# EAGLE design polarplotter allegro v3 (EAGLE 5.07)
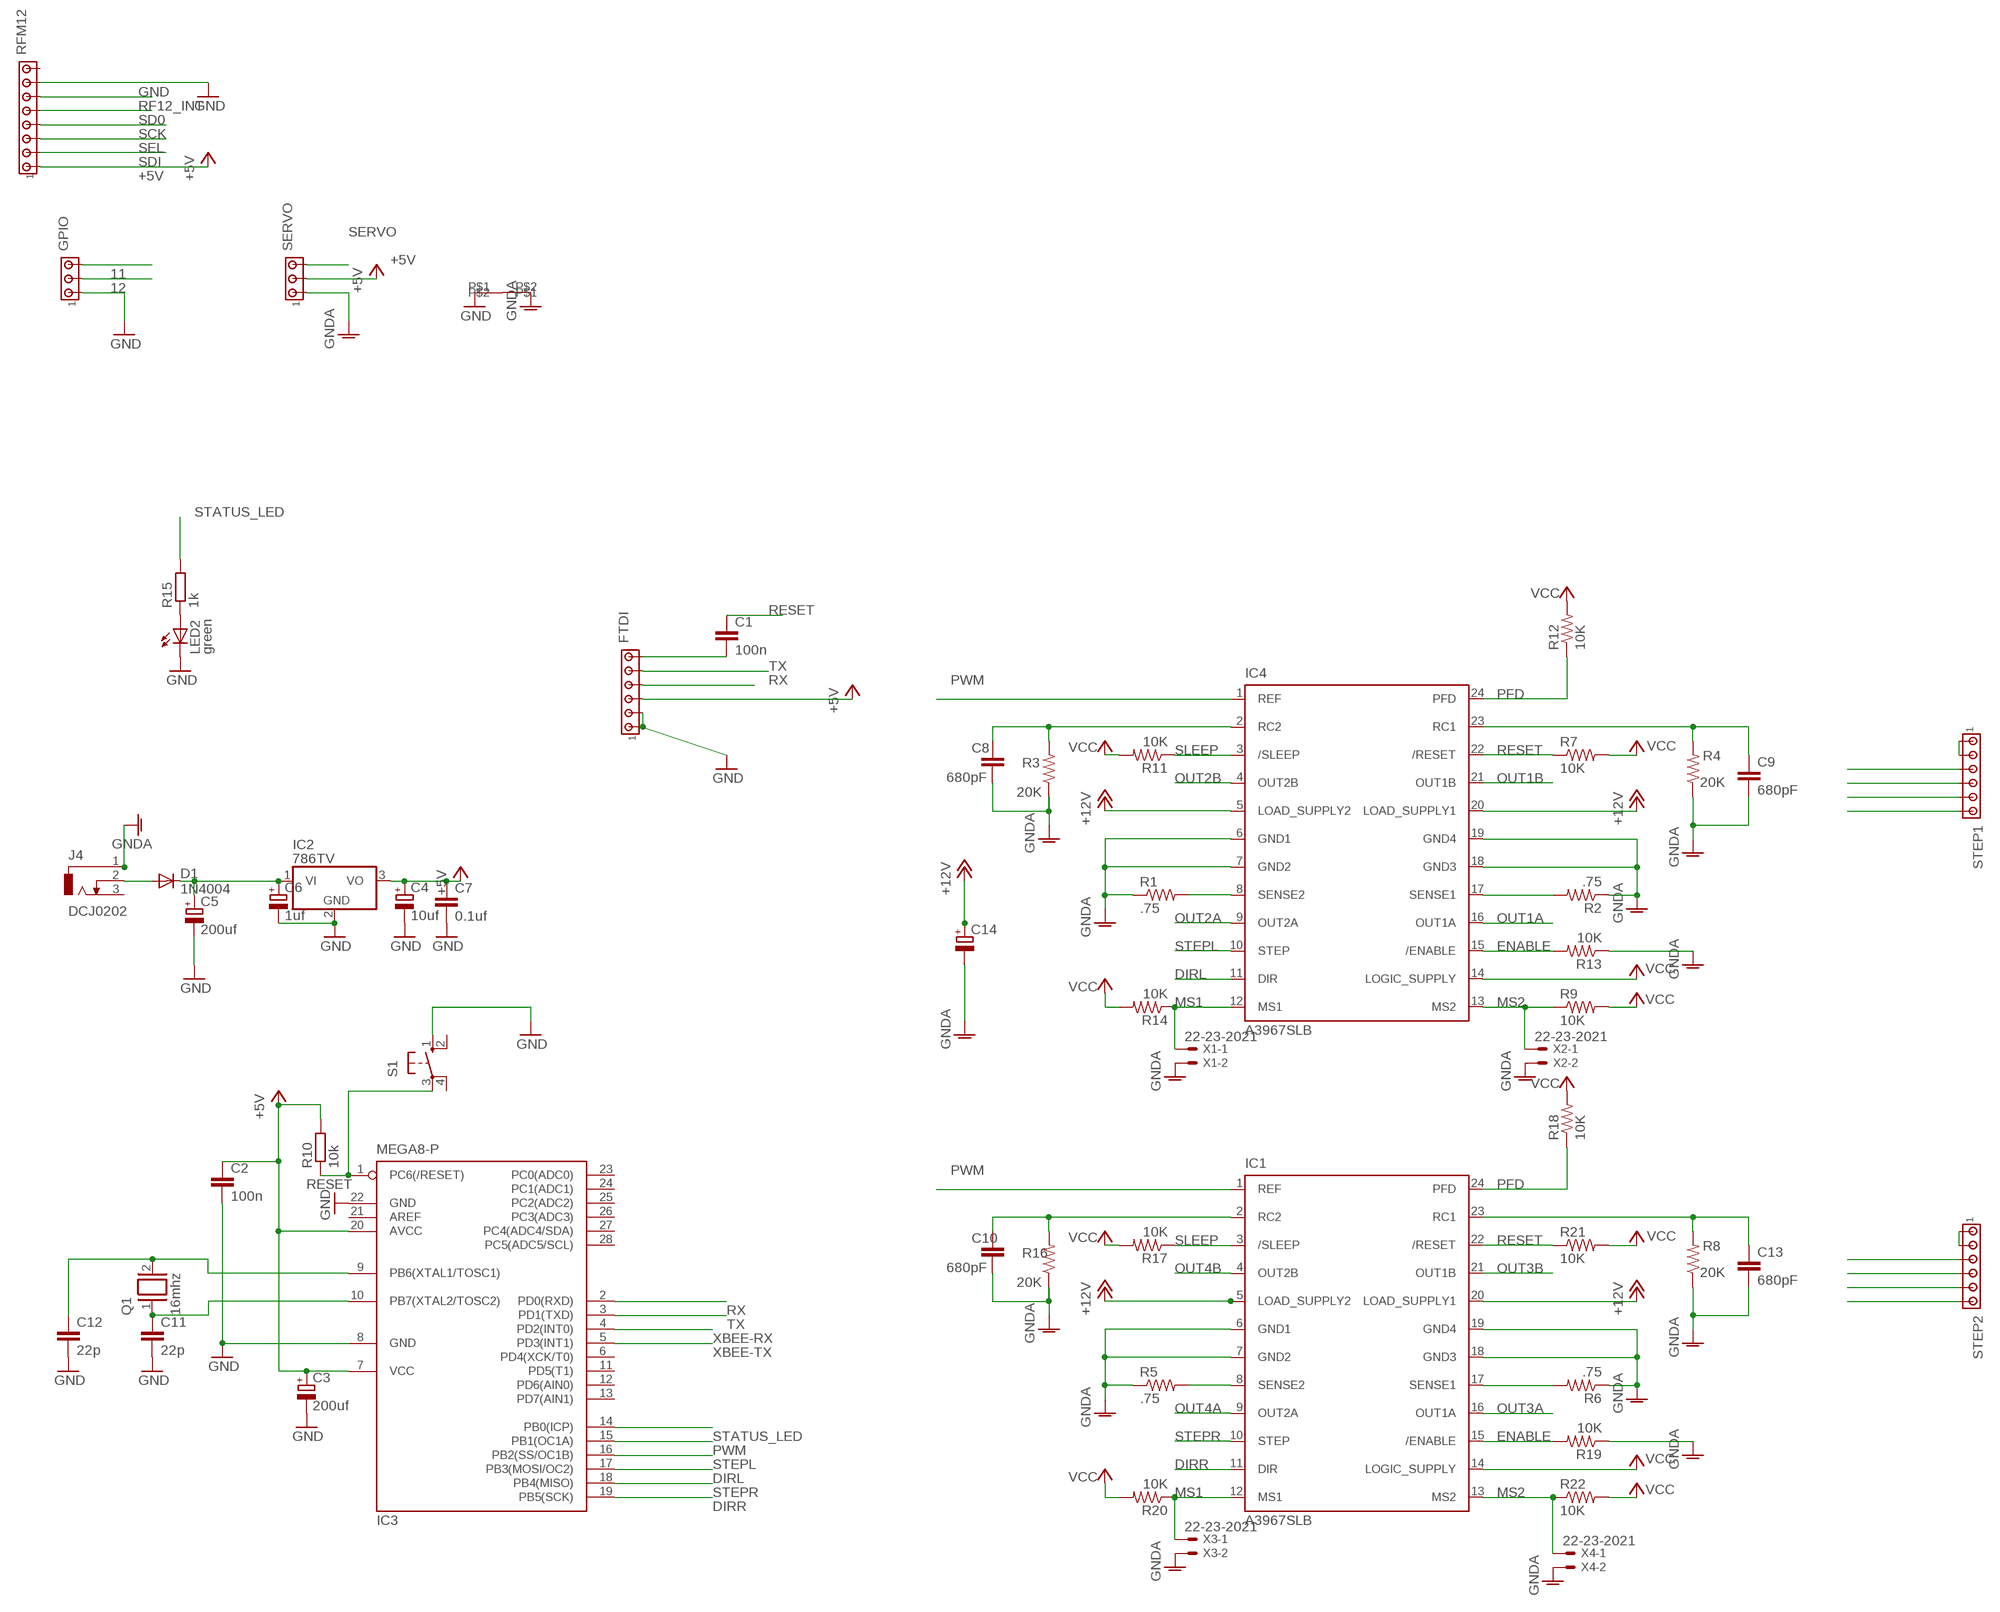
[diagram p0: schematic, sheet 1]

## Parts
C1  100n  C-EU050-025X075  [C050-025X075]
C2  100n  C-EU050-025X075  [C050-025X075]
C3  200uf  CPOL-EUE2-4  [E2-4]
C4  10uf  CPOL-EUE2-4  [E2-4]
C5  200uf  CPOL-EUE3.5-8  [E3,5-8]
C6  1uf  CPOL-EUE2-4  [E2-4]
C7  0.1uf  C-EU050-025X075  [C050-025X075]
C8  680pF  CAP0402  [C0402]
C9  680pF  CAP0402  [C0402]
C10  680pF  CAP0402  [C0402]
C11  22p  C-EU050-025X075  [C050-025X075]
C12  22p  C-EU050-025X075  [C050-025X075]
C13  680pF  CAP0402  [C0402]
C14  CPOL-EU153CLV-0810  [153CLV-0810]
D1  1N4004  [DO41-10]
FTDI  MTA06-100  [10X06MTA]
GPIO  MTA03-100  [10X03MTA]
IC1  A3967SLB  [SO24W]
IC2  786TV  [TO220V]
IC3  MEGA8-P  [DIL28-3]
IC4  A3967SLB  [SO24W]
J4  DCJ0202  [DCJ0202]
LED2  green  LED5MM  [LED5MM]
Q1  16mhz  XTAL/S  [QS]
R1  .75  R-US_R0805  [R0805]
R2  .75  R-US_R0805  [R0805]
R3  20K  RESISTOR0402  [C0402]
R4  20K  RESISTOR0402  [C0402]
R5  .75  R-US_R0805  [R0805]
R6  .75  R-US_R0805  [R0805]
R7  10K  RESISTOR0402  [C0402]
R8  20K  RESISTOR0402  [C0402]
R9  10K  RESISTOR0402  [C0402]
R10  10k  R-EU_0204/7  [0204/7]
R11  10K  RESISTOR0402  [C0402]
R12  10K  RESISTOR0402  [C0402]
R13  10K  RESISTOR0402  [C0402]
R14  10K  RESISTOR0402  [C0402]
R15  1k  R-EU_0204/7  [0204/7]
R16  20K  RESISTOR0402  [C0402]
R17  10K  RESISTOR0402  [C0402]
R18  10K  RESISTOR0402  [C0402]
R19  10K  RESISTOR0402  [C0402]
R20  10K  RESISTOR0402  [C0402]
R21  10K  RESISTOR0402  [C0402]
R22  10K  RESISTOR0402  [C0402]
RFM12  MTA08-100  [10X08MTA]
S1  10-XX  [B3F-10XX]
SERVO  MTA03-100  [10X03MTA]
STEP1  MTA06-100  [10X06MTA]
STEP2  MTA06-100  [10X06MTA]
U$4  SHORT  [SHORT]
X1  22-23-2021  [22-23-2021]
X2  22-23-2021  [22-23-2021]
X3  22-23-2021  [22-23-2021]
X4  22-23-2021  [22-23-2021]

## Nets
11: GPIO.3
12: GPIO.2
+5V: C2.1 C3.+ C4.+ C7.1 FTDI.4 IC2.3(VO) IC3.7(VCC) IC3.20(AVCC) R10.2 R12.2 R18.2 RFM12.1 SERVO.2 ; supply symbol labelled VCC
+12V [power]: C14.+ IC1.5(LOAD_SUPPLY2) IC1.20(LOAD_SUPPLY1) IC4.5(LOAD_SUPPLY2) IC4.20(LOAD_SUPPLY1)
DIRL: IC3.17(PB3(MOSI/OC2)) IC4.11(DIR)
DIRR: IC1.11(DIR) IC3.19(PB5(SCK))
ENABLE: IC1.15(/ENABLE) IC4.15(/ENABLE) R13.2 R19.2
GND: C2.2 C3.- C4.- C5.- C6.- C7.2 C11.2 C12.2 FTDI.5 FTDI.6 GPIO.1 IC2.2(GND) IC3.8(GND) IC3.22(GND) LED2.K(C) RFM12.7 S1.1(S) U$4.P$1
GNDA [power]: C8.2 C9.2 C10.2 C13.2 C14.- IC1.6(GND1) IC1.7(GND2) IC1.18(GND3) IC1.19(GND4) IC4.6(GND1) IC4.7(GND2) IC4.18(GND3) IC4.19(GND4) J4.1 R1.1 R2.1 R3.1 R4.1 R5.1 R6.1 R8.1 R13.1 R16.1 R19.1 SERVO.1 U$4.P$2 X1.2 X2.2 X3.2 X4.2
MOTORSUPPLY [power]: STEP1.5 STEP1.6
MOTORSUPPLY1 [power]: STEP2.5 STEP2.6
MS1: IC1.12(MS1) IC4.12(MS1) R14.1 R20.1 X1.1 X3.1
MS2: IC1.13(MS2) IC4.13(MS2) R9.1 R22.1 X2.1 X4.1
N$1: IC1.8(SENSE2) R5.2
N$2: D1.A J4.2
N$3: IC4.8(SENSE2) R1.2
N$4: IC1.17(SENSE1) R6.2
N$5: C1.2 FTDI.1
N$6: C10.1 IC1.2(RC2) R16.2
N$7: C13.1 IC1.23(RC1) R8.2
N$10: C11.1 IC3.10(PB7(XTAL2/TOSC2)) Q1.1
N$11: C12.1 IC3.9(PB6(XTAL1/TOSC1)) Q1.2
N$14: IC4.17(SENSE1) R2.2
N$15: LED2.A R15.1
N$16: C8.1 IC4.2(RC2) R3.2
N$19: C5.+ C6.+ D1.C IC2.1(VI)
N$20: C9.1 IC4.23(RC1) R4.2
OUT1A: IC4.16(OUT1A) STEP1.4
OUT1B: IC4.21(OUT1B) STEP1.3
OUT2A: IC4.9(OUT2A) STEP1.2
OUT2B: IC4.4(OUT2B) STEP1.1
OUT3A: IC1.16(OUT1A) STEP2.4
OUT3B: IC1.21(OUT1B) STEP2.3
OUT4A: IC1.9(OUT2A) STEP2.2
OUT4B: IC1.4(OUT2B) STEP2.1
PFD: IC1.24(PFD) IC4.24(PFD) R12.1 R18.1
PWM: IC1.1(REF) IC3.15(PB1(OC1A)) IC4.1(REF)
RESET: C1.1 IC1.22(/RESET) IC3.1(PC6(/RESET)) IC4.22(/RESET) R7.1 R10.1 R21.1 S1.3(P)
RF12_INT: RFM12.6
RX: FTDI.3 IC3.2(PD0(RXD))
SCK: RFM12.4
SD0: RFM12.5
SDI: RFM12.2
SEL: RFM12.3
SERVO: SERVO.3
SLEEP: IC1.3(/SLEEP) IC4.3(/SLEEP) R11.1 R17.1
STATUS_LED: IC3.14(PB0(ICP)) R15.2
STEPL: IC3.16(PB2(SS/OC1B)) IC4.10(STEP)
STEPR: IC1.10(STEP) IC3.18(PB4(MISO))
TX: FTDI.2 IC3.3(PD1(TXD))
VCC: IC1.14(LOGIC_SUPPLY) IC4.14(LOGIC_SUPPLY) R7.2 R9.2 R11.2 R14.2 R17.2 R20.2 R21.2 R22.2
XBEE-RX: IC3.4(PD2(INT0))
XBEE-TX: IC3.5(PD3(INT1))
Unconnected: IC3.6(PD4(XCK/T0)) IC3.11(PD5(T1)) IC3.12(PD6(AIN0)) IC3.13(PD7(AIN1)) IC3.21(AREF) IC3.23(PC0(ADC0)) IC3.24(PC1(ADC1)) IC3.25(PC2(ADC2)) IC3.26(PC3(ADC3)) IC3.27(PC4(ADC4/SDA)) IC3.28(PC5(ADC5/SCL)) J4.3 RFM12.8 S1.2(S1) S1.4(P1)

## Library data of the parts
C1 C2 C7 C11 C12 = matt rcl:C-EU: CAPACITOR, European symbol
C3-C6 C14 = matt rcl:CPOL-EU: POLARIZED CAPACITOR, European symbol
C8-C10 C13 = SparkFun03_30_09:CAP: Capacitor Standard 0603 ceramic capacitor, and 0.1" leaded capacitor.
D1 = matt diode:1N4004: DIODE general purpose rectifier, 1 A
FTDI STEP1 STEP2 = matt con-amp:MTA06-100: AMP connector
GPIO SERVO = matt con-amp:MTA03-100: AMP connector
IC1 IC4 = Allegro:A3967SLB: ANALOG DEVICES
IC2 = linear:78*: Positive VOLTAGE REGULATOR Source: http://cache.national.com/ds/LM/LM78L05.pdf http://www.fairchildsemi.com/ds/LM/LM7805.pdf
IC3 = matt atmel:MEGA8-P: MICROCONTROLLER 8 Kbytes FLASH, 1 kbytes SRAM, 512 bytes EEPROM, USART, 4-channel 10 bit ADC, 2-channel 8 bit ADC Pin compatible with Atmega48, ATMega88, ATMega168 Source: avr.lbr
J4 = con-jack:DCJ0202: DC POWER JACK Source: DCJ0202.pdf
LED2 = matt led:LED: LED OSRAM: - CHIPLED LG R971, LG N971, LY N971, LG Q971, LY Q971, LO R971, LY R971 LH N974, LH R974 LS Q976, LO Q976, LY Q976 LO Q996 - Hyper CHIPLED LW Q18S LB Q993, LB Q99A, LB R99A - SideLED LS A670, LO A670, LY A670, LG A670, LP A670 LB A673, LV A673, LT A673, LW A673 LH A674 LY A675 LS A676, LA A676, LO A676, LY A676, LW A676 LS A679, LY A679, LG A679 - Hyper Micro SIDELED® LS Y876, LA Y876, LO Y876, LY Y876 LT Y87S - SmartLED LW L88C, LW L88S LB L89C, LB L89S, LG L890 LS L89K, LO L89K, LY L89K LS L896, LA L896, LO L896, LY L896 - TOPLED LS T670, LO T670, LY T670, LG T670, LP T670 LSG T670, LSP T670, LSY T670, LOP T670, LYG T670 LG T671, LOG T671, LSG T671 LB T673, LV T673, LT T673, LW T673 LH T674 LS T676, LA T676, LO T676, LY T676, LB T676, LH T676, LSB T676, LW T676 LB T67C, LV T67C, LT T67C, LS T67K, LO T67K, LY T67K, LW E67C LS E67B, LA E67B, LO E67B, LY E67B, LB E67C, LV E67C, LT E67C LW T67C LS T679, LY T679, LG T679 LS T770, LO T770, LY T770, LG T770, LP T770 LB T773, LV T773, LT T773, LW T773 LH T774 LS E675, LA E675, LY E675, LS T675 LS T776, LA T776, LO T776, LY T776, LB T776 LHGB T686 LT T68C, LB T68C - Hyper Mini TOPLED® LB M676 - Mini TOPLED Santana® LG M470 LS M47K, LO M47K, LY M47K Source: http://www.osram.convergy.de LUXEON: - LUMILED® LXK2-PW12-R00, LXK2-PW12-S00, LXK2-PW14-U00, LXK2-PW14-V00 LXK2-PM12-R00, LXK2-PM12-S00, LXK2-PM14-U00 LXK2-PE12-Q00, LXK2-PE12-R00, LXK2-PE12-S00, LXK2-PE14-T00, LXK2-PE14-U00 LXK2-PB12-K00, LXK2-PB12-L00, LXK2-PB12-M00, LXK2-PB14-N00, LXK2-PB14-P00, LXK2-PB14-Q00 LXK2-PR12-L00, LXK2-PR12-M00, LXK2-PR14-Q00, LXK2-PR14-R00 LXK2-PD12-Q00, LXK2-PD12-R00, LXK2-PD12-S00 LXK2-PH12-R00, LXK2-PH12-S00 LXK2-PL12-P00, LXK2-PL12-Q00, LXK2-PL12-R00 Source: www.luxeon.com KINGBRIGHT: KA-3528ASYC Source: www.kingbright.com
Q1 = matt special:XTAL/S: CRYSTAL
R1 R2 R5 R6 = rcl:R-US_: RESISTOR, American symbol
R3 R4 R7-R9 R11-R14 R16-R22 = SparkFun03_30_09:RESISTOR: Resistor Basic schematic elements and footprints for 0603, 1206, and PTH 1/10th watt (small) resistors.
R10 R15 = matt rcl:R-EU_: RESISTOR, European symbol
RFM12 = matt con-amp:MTA08-100: AMP connector
S1 = switch-omron:10-XX: OMRON SWITCH
U$4 = matt:SHORT
X1-X4 = con-molex:22-23-2021: .100" (2.54mm) Center Header - 2 Pin

## Net classes
1 power: width 3 mm

## Board
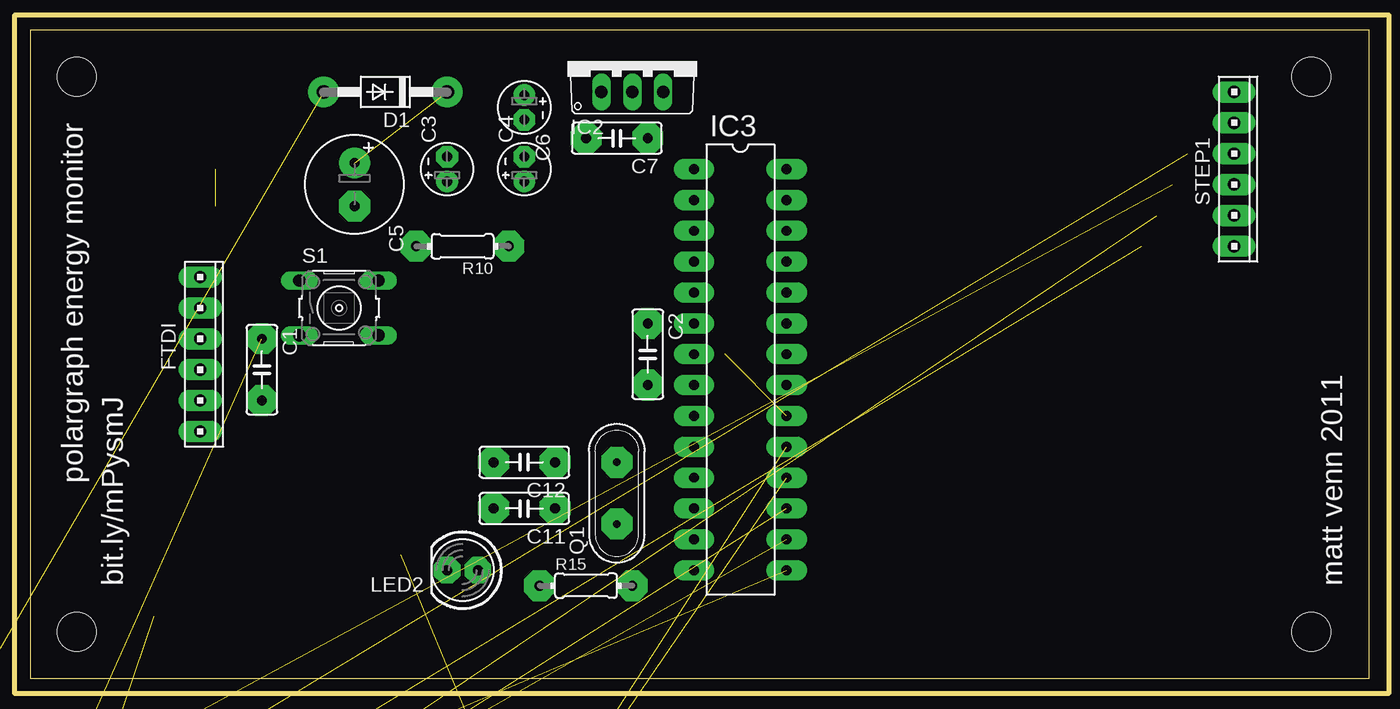
[diagram p1: board, top side]
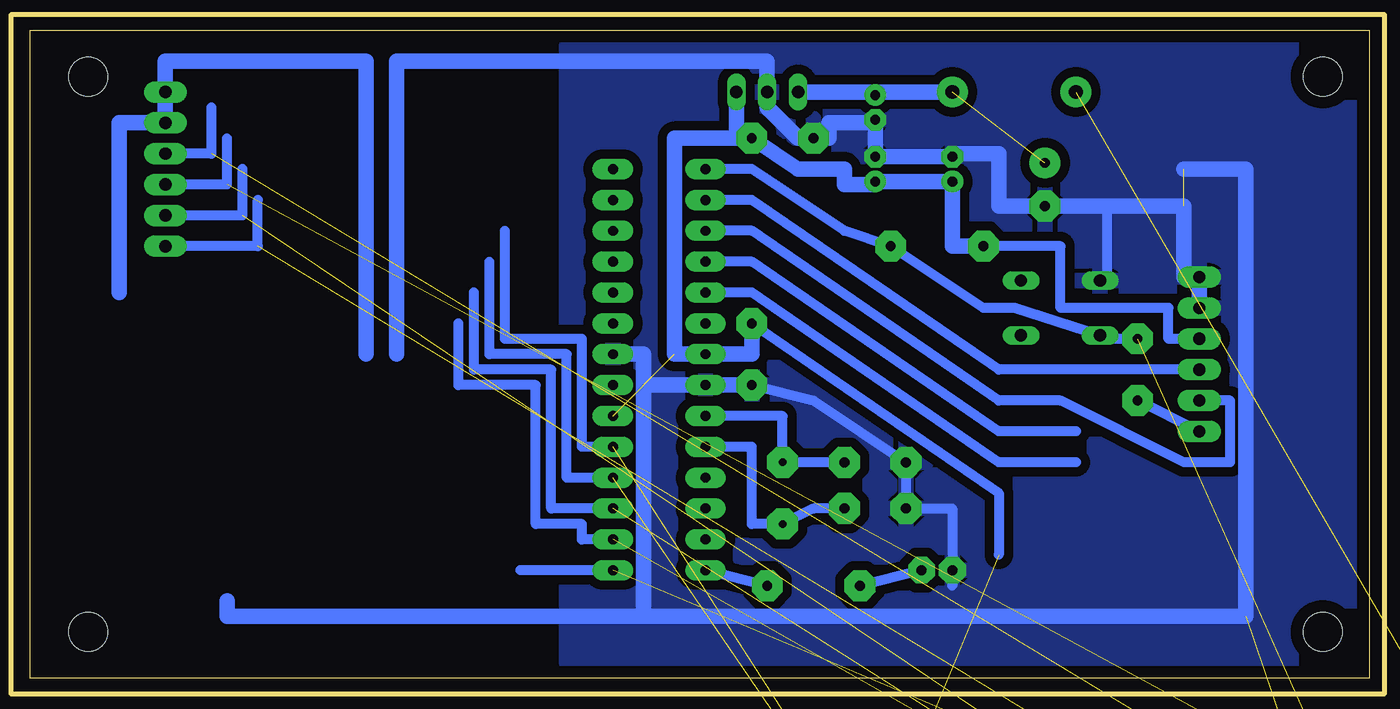
[diagram p2: board, bottom side, seen from below]

Size 110.16 x 53.33 mm. Coordinates in mm from the lower left corner, seen from the top.
Outline: 0,0 110.16,0 110.16,53.33 0,53.33 0,0
Copper layers (1*16): Top 0.035mm / dielectric 1.5mm / Bottom 0.035mm
Design rules "default": minimum track width 10mil, minimum drill 24mil, track to track 8mil, track to pad 8mil, pad to pad 8mil, via to via 8mil, smd to smd 8mil, copper to edge 40mil, drill to drill 8mil, minimum pad ring 10mil, minimum via ring 8mil, stop-mask expansion 4mil, vias tented up to drill 0mil, thermal gap 10mil
Holes 3.2 mm at 3.81,3.81 105.41,3.81 105.41,49.53 3.81,49.53
Milling: 4 lines

### Footprints (pad centres in the part's own frame; a part is rotated, then mirrored left to right if it is on the bottom)
C050-025X075 = drill 0.813 pad 2.54 octagon: 1 -2.54,0; 2 2.54,0
E2-4 = drill 0.813 pad 1.778 round: + -1.016,0 | drill 0.813 pad 1.778 octagon: - 1.016,0
E3,5-8 = drill 0.813 pad 2.54 round: + -1.778,0 | drill 0.813 pad 2.54 octagon: - 1.778,0
C0402 = smd 0.7 x 0.9: 1 -0.65,0; 2 0.65,0
153CLV-0810 = smd 3.5 x 2.5: + 3.25,0; - -3.25,0
DO41-10 = drill 1.118 pad 2.54 round: A 5.08,0; C -5.08,0
10X06MTA = drill 1.016 pad 1.778 long: 1 6.35,0; 2 3.81,0; 3 1.27,0; 4 -1.27,0; 5 -3.81,0; 6 -6.35,0
10X03MTA = drill 1.016 long: 1 2.54,0; 2 0,0; 3 -2.54,0
SO24W = smd 0.6 x 2.2: 1 -6.985,-4.6; 2 -5.715,-4.6; 3 -4.445,-4.6; 4 -3.175,-4.6; 5 -1.905,-4.6; 6 -0.635,-4.6; 7 0.635,-4.6; 8 1.905,-4.6; 9 3.175,-4.6; 10 4.445,-4.6; 11 5.715,-4.6; 12 6.985,-4.6; 13 6.985,4.6; 14 5.715,4.6; 15 4.445,4.6; 16 3.175,4.6; 17 1.905,4.6; 18 0.635,4.6; 19 -0.635,4.6; 20 -1.905,4.6; 21 -3.175,4.6; 22 -4.445,4.6; 23 -5.715,4.6; 24 -6.985,4.6
TO220V = drill 1.016 long: 1 -2.54,-2.54; 2 0,-2.54; 3 2.54,-2.54
DIL28-3 = drill 0.813 pad 1.676 long: 1 -16.51,-3.81; 2 -13.97,-3.81; 3 -11.43,-3.81; 4 -8.89,-3.81; 5 -6.35,-3.81; 6 -3.81,-3.81; 7 -1.27,-3.81; 8 1.27,-3.81; 9 3.81,-3.81; 10 6.35,-3.81; 11 8.89,-3.81; 12 11.43,-3.81; 13 13.97,-3.81; 14 16.51,-3.81; 15 16.51,3.81; 16 13.97,3.81; 17 11.43,3.81; 18 8.89,3.81; 19 6.35,3.81; 20 3.81,3.81; 21 1.27,3.81; 22 -1.27,3.81; 23 -3.81,3.81; 24 -6.35,3.81; 25 -8.89,3.81; 26 -11.43,3.81; 27 -13.97,3.81; 28 -16.51,3.81
DCJ0202 = drill 1 pad 2 long: 1 0,3.1; 2 4.8,0; 3 0,-3
LED5MM = drill 0.813 pad 2.184 octagon: A -1.27,0; K 1.27,0
QS = drill 0.61 pad 2.54 octagon: 1 -2.54,0; 2 2.54,0
R0805 = smd 1.3 x 1.5: 1 -0.85,0; 2 0.85,0
0204/7 = drill 0.813 pad 2.54 octagon: 1 -3.81,0; 2 3.81,0
10X08MTA = drill 1.016 long: 1 8.89,0; 2 6.35,0; 3 3.81,0; 4 1.27,0; 5 -1.27,0; 6 -3.81,0; 7 -6.35,0; 8 -8.89,0
B3F-10XX = drill 1.016 long: 1 -3.251,2.261; 2 3.251,2.261; 3 -3.251,-2.261; 4 3.251,-2.261
SHORT = drill 0.8 square: P$1 -2.54,0; P$2 0,0
22-23-2021 = drill 1 long: 1 -1.27,0; 2 1.27,0

### Placement (x,y rotation side)
C1  19.05,25.4 270 top
C2  50.8,26.67 270 top
C3  34.29,41.91 90 top
C4  40.64,41.91 90 top
C5  26.67,40.64 270 top
C6  40.64,46.99 270 top
C7  48.26,44.45 180 top
C8  17.46,-22.54 0 top  (outside the outline)
C9  27.46,-22.54 0 top  (outside the outline)
C10  27.46,-62.54 0 top  (outside the outline)
C11  40.64,13.97 180 top
C12  40.64,17.78 180 top
C13  37.46,-62.54 0 top  (outside the outline)
C14  -82.54,-142.54 0 top  (outside the outline)
D1  29.21,48.26 180 top
FTDI  13.97,26.67 270 top
GPIO  -42.54,-142.54 0 top  (outside the outline)
IC1  7.46,-52.54 0 top  (outside the outline)
IC2  49.53,50.8 0 top
IC3  58.42,25.4 270 top
IC4  7.46,-12.54 0 top  (outside the outline)
J4  -62.54,-92.54 0 top  (outside the outline)
LED2  35.56,8.89 180 top
Q1  48.26,15.24 90 top
R1  27.46,-12.54 0 top  (outside the outline)
R2  37.46,-12.54 0 top  (outside the outline)
R3  37.46,-22.54 0 top  (outside the outline)
R4  47.46,-22.54 0 top  (outside the outline)
R5  7.46,-62.54 0 top  (outside the outline)
R6  17.46,-62.54 0 top  (outside the outline)
R7  17.46,-32.54 0 top  (outside the outline)
R8  7.46,-72.54 0 top  (outside the outline)
R9  27.46,-32.54 0 top  (outside the outline)
R10  35.56,35.56 180 top
R11  37.46,-32.54 0 top  (outside the outline)
R12  47.46,-32.54 0 top  (outside the outline)
R13  7.46,-42.54 0 top  (outside the outline)
R14  17.46,-42.54 0 top  (outside the outline)
R15  45.72,7.62 0 top
R16  17.46,-72.54 0 top  (outside the outline)
R17  27.46,-72.54 0 top  (outside the outline)
R18  37.46,-72.54 0 top  (outside the outline)
R19  7.46,-82.54 0 top  (outside the outline)
R20  17.46,-82.54 0 top  (outside the outline)
R21  27.46,-82.54 0 top  (outside the outline)
R22  37.46,-82.54 0 top  (outside the outline)
RFM12  -62.54,-142.54 0 top  (outside the outline)
S1  25.4,30.48 0 top
SERVO  -32.54,-142.54 0 top  (outside the outline)
STEP1  99.06,41.91 270 top
STEP2  27.46,-52.54 0 top  (outside the outline)
U$4  -22.54,-152.54 0 top  (outside the outline)
X1  -12.54,-72.54 0 top  (outside the outline)
X2  -32.54,-72.54 0 top  (outside the outline)
X3  -52.54,-72.54 0 top  (outside the outline)
X4  -72.54,-72.54 0 top  (outside the outline)

### Tracks (layer width: path | path; a pad name or v marks a point on that pad's centre or on a via)
+5V  (5 unrouted)
  Bottom 0.406: C4.+ 40.64,40.64
  Bottom 0.813: R10.2 25.4,35.56 25.4,30.48 16.51,30.48 16.51,27.94 FTDI.4 | 30.48,10.16 30.48,15.24 C2.1
  Bottom 1.27: C2.1 50.8,26.67 IC3.7 57.15,26.67 57.15,44.45 C7.1 | C4.+ C3.+ 34.29,35.56 R10.2 | C7.1 46.99,41.91 43.18,41.91 43.18,40.64 40.64,40.64 | C7.1 52.07,44.45 IC2.3
+12V  (4 unrouted)
DIRL  (1 unrouted)
  Bottom 0.813: IC3.17 67.31,13.97 67.31,25.4 73.66,25.4 73.66,31.75
DIRR  (1 unrouted)
  Bottom 0.813: 71.12,36.83 71.12,27.94 64.77,27.94 64.77,19.05 IC3.19
ENABLE  (3 unrouted)
GND  (4 unrouted)
  Bottom 0.406: 34.29,43.18 C3.- | C6.- 40.64,45.72 | 21.59,32.74 S1.1
  Bottom 0.813: 34.29,7.62 LED2.K 34.29,13.97 C11.2 C12.2 45.72,22.86 C2.2 | 21.59,38.86 21.59,32.74
  Bottom 1.27: FTDI.5 FTDI.6 15.24,33.02 15.24,38.86 21.59,38.86 C5.- 30.48,38.86 30.48,43.18 34.29,43.18 | C2.2 IC3.8 59.69,24.13 | C3.- C4.- C6.- | 80.01,26.67 80.01,50.8 49.53,50.8 IC2.2 49.53,46.99 46.99,44.45 C7.2 44.45,44.45 44.45,45.72 40.64,45.72 | 93.98,6.39 93.98,5.08 59.69,5.08 | 59.69,5.08 13.97,5.08 10.16,5.08 10.16,41.91 15.24,41.91 | IC3.22 59.69,26.67 59.69,24.13 | 59.69,5.08 59.69,24.13
  pour Bottom (isolate 0.762): 1.27,52.07 66.04,52.07 66.04,1.27 1.27,1.27
GNDA  (29 unrouted)
MOTORSUPPLY
  Bottom 1.27: 82.55,26.67 82.55,50.8 99.06,50.8 STEP1.6 STEP1.5 102.87,45.72 102.87,31.75
MOTORSUPPLY1  (1 unrouted)
MS1  (5 unrouted)
MS2  (5 unrouted)
N$1  (1 unrouted)
N$2  (1 unrouted)
N$3  (1 unrouted)
N$4  (1 unrouted)
N$5
  Bottom 0.813: FTDI.1 C1.2
N$6  (2 unrouted)
N$7  (2 unrouted)
N$10
  Bottom 0.813: IC3.10 50.8,19.05 50.8,12.7 Q1.1 45.72,13.97 C11.1
N$11
  Bottom 0.813: IC3.9 48.26,21.59 Q1.2 C12.1
N$14  (1 unrouted)
N$15
  Bottom 0.813: LED2.A R15.1
N$16  (2 unrouted)
N$19  (1 unrouted)
  Bottom 0.406: 40.64,48.26 C6.+
  Bottom 1.27: D1.C 40.64,48.26 IC2.1
N$20  (2 unrouted)
OUT1A  (1 unrouted)
  Bottom 0.813: 95.25,46.99 95.25,43.18 STEP1.4
OUT1B  (1 unrouted)
  Bottom 0.813: 93.98,44.45 93.98,40.64 STEP1.3
OUT2A  (1 unrouted)
  Bottom 0.813: 92.71,41.91 92.71,38.1 STEP1.2
OUT2B  (1 unrouted)
  Bottom 0.813: 91.44,39.37 91.44,35.56 STEP1.1
OUT3A  (1 unrouted)
OUT3B  (1 unrouted)
OUT4A  (1 unrouted)
OUT4B  (1 unrouted)
PFD  (3 unrouted)
PWM  (2 unrouted)
  Bottom 0.813: IC3.15 69.85,8.89
RESET  (4 unrouted)
  Bottom 0.406: 22.15,27.94 S1.3
  Bottom 0.813: C1.1 22.15,27.94 | S1.3 29.21,30.48 31.75,30.48 R10.1 43.18,36.83 50.8,41.91 IC3.1
RX
  Bottom 0.813: IC3.2 50.8,39.37 30.48,25.4 FTDI.3
SLEEP  (3 unrouted)
STATUS_LED
  Bottom 0.813: R15.2 IC3.14
STEPL  (1 unrouted)
  Bottom 0.813: 74.93,29.21 74.93,24.13 68.58,24.13 68.58,12.7 64.77,12.7 64.77,11.43 IC3.16
STEPR  (1 unrouted)
  Bottom 0.813: 72.39,34.29 72.39,26.67 66.04,26.67 66.04,16.51 IC3.18
TX
  Bottom 0.813: IC3.3 50.8,36.83 30.48,22.86 25.4,22.86 15.24,17.78 11.43,17.78 11.43,22.86 FTDI.2
VCC  (9 unrouted)
XBEE-RX
  Bottom 0.813: IC3.4 50.8,34.29 30.48,20.32 24.13,20.32
XBEE-TX
  Bottom 0.813: IC3.5 50.8,31.75 30.48,17.78 24.13,17.78

### Text on the board
tPlace: polargraph energy monitor | bit.ly/mPysmJ | matt venn 2011